# EAGLE schematic accessControl (EAGLE 9.6.2)
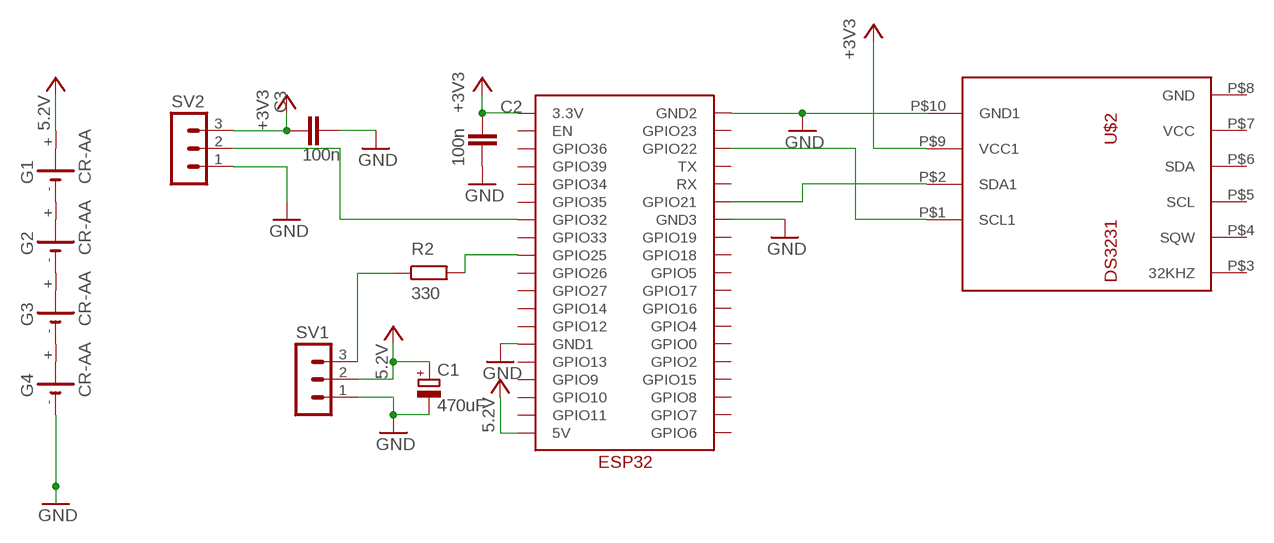
[diagram p0: schematic, sheet 1]

## Parts
C1  470uF  CPOL-EU085CS-1AR  [085CS_1AR]
C2  100n  C  (no package)
C3  100n  C  (no package)
G1  CR-AA  [CRAA]
G2  CR-AA  [CRAA]
G3  CR-AA  [CRAA]
G4  CR-AA  [CRAA]
R2  330  R  (no package)
SV1  MA03-1  [MA03-1]
SV2  MA03-1  [MA03-1]
U$1  ESP32  [ESP32]
U$2  DS3231  [DS3231]

## Nets
+3V3 [3v3]: C2.1 C3.1 SV2.3 U$1.3.3V U$2.P$9(VCC1)
+5V [5V]: C1.+ G1.+ SV1.2 U$1.5V ; supply symbol labelled 5.2V
GND [GND]: C1.- C2.2 C3.2 G4.- SV1.1 SV2.1 U$1.GND1 U$1.GND2 U$1.GND3 U$2.P$10(GND1)
N$1: SV2.2 U$1.GPIO32
N$2: R2.2 U$1.GPIO25
N$3: R2.1 SV1.3
N$4: G1.- G2.+
N$5: G2.- G3.+
N$6: G3.- G4.+
N$8: U$1.GPIO22 U$2.P$1(SCL1)
N$9: U$1.GPIO21 U$2.P$2(SDA1)
Unconnected: G1.+@1(+) G2.+@1(+) G3.+@1(+) G4.+@1(+) U$1.EN U$1.GPIO0 U$1.GPIO2 U$1.GPIO4 U$1.GPIO5 U$1.GPIO6 U$1.GPIO7 U$1.GPIO8 U$1.GPIO9 U$1.GPIO10 U$1.GPIO11 U$1.GPIO12 U$1.GPIO13 U$1.GPIO14 U$1.GPIO15 U$1.GPIO16 U$1.GPIO17 U$1.GPIO18 U$1.GPIO19 U$1.GPIO23 U$1.GPIO26 U$1.GPIO27 U$1.GPIO33 U$1.GPIO34 U$1.GPIO35 U$1.GPIO36 U$1.GPIO39 U$1.RX U$1.TX U$2.P$3(32KHZ) U$2.P$4(SQW) U$2.P$5(SCL) U$2.P$6(SDA)

## Power pins joined to a net without a drawn wire
GND: U$2.P$8(GND)
VCC: U$2.P$7(VCC)

## Library data of the parts
C1 = rcl:CPOL-EU: POLARIZED CAPACITOR, European symbol; SPICEPREFIX: C
C2 C3 = ngspice-simulation:C: CAPACITOR
G1-G4 = battery:CR-AA: LI BATTERY Varta CRAA-SLF
R2 = ngspice-simulation:R: RESISTOR
SV1 SV2 = con-lstb:MA03-1: PIN HEADER; OC_FARNELL: unknown; OC_NEWARK: unknown
U$1 = ESP32:ESP32
U$2 = DS3231:DS3231

## Net classes
0 signal: width 0.254 mm, clearance 0.254 mm
1 5V: width 0.61 mm, clearance 0.305 mm
3 3v3: width 0.406 mm, clearance 0.305 mm
4 GND: width 0.813 mm